# Altium schematic sheet Main.SchDoc
size 863 x 558 mm
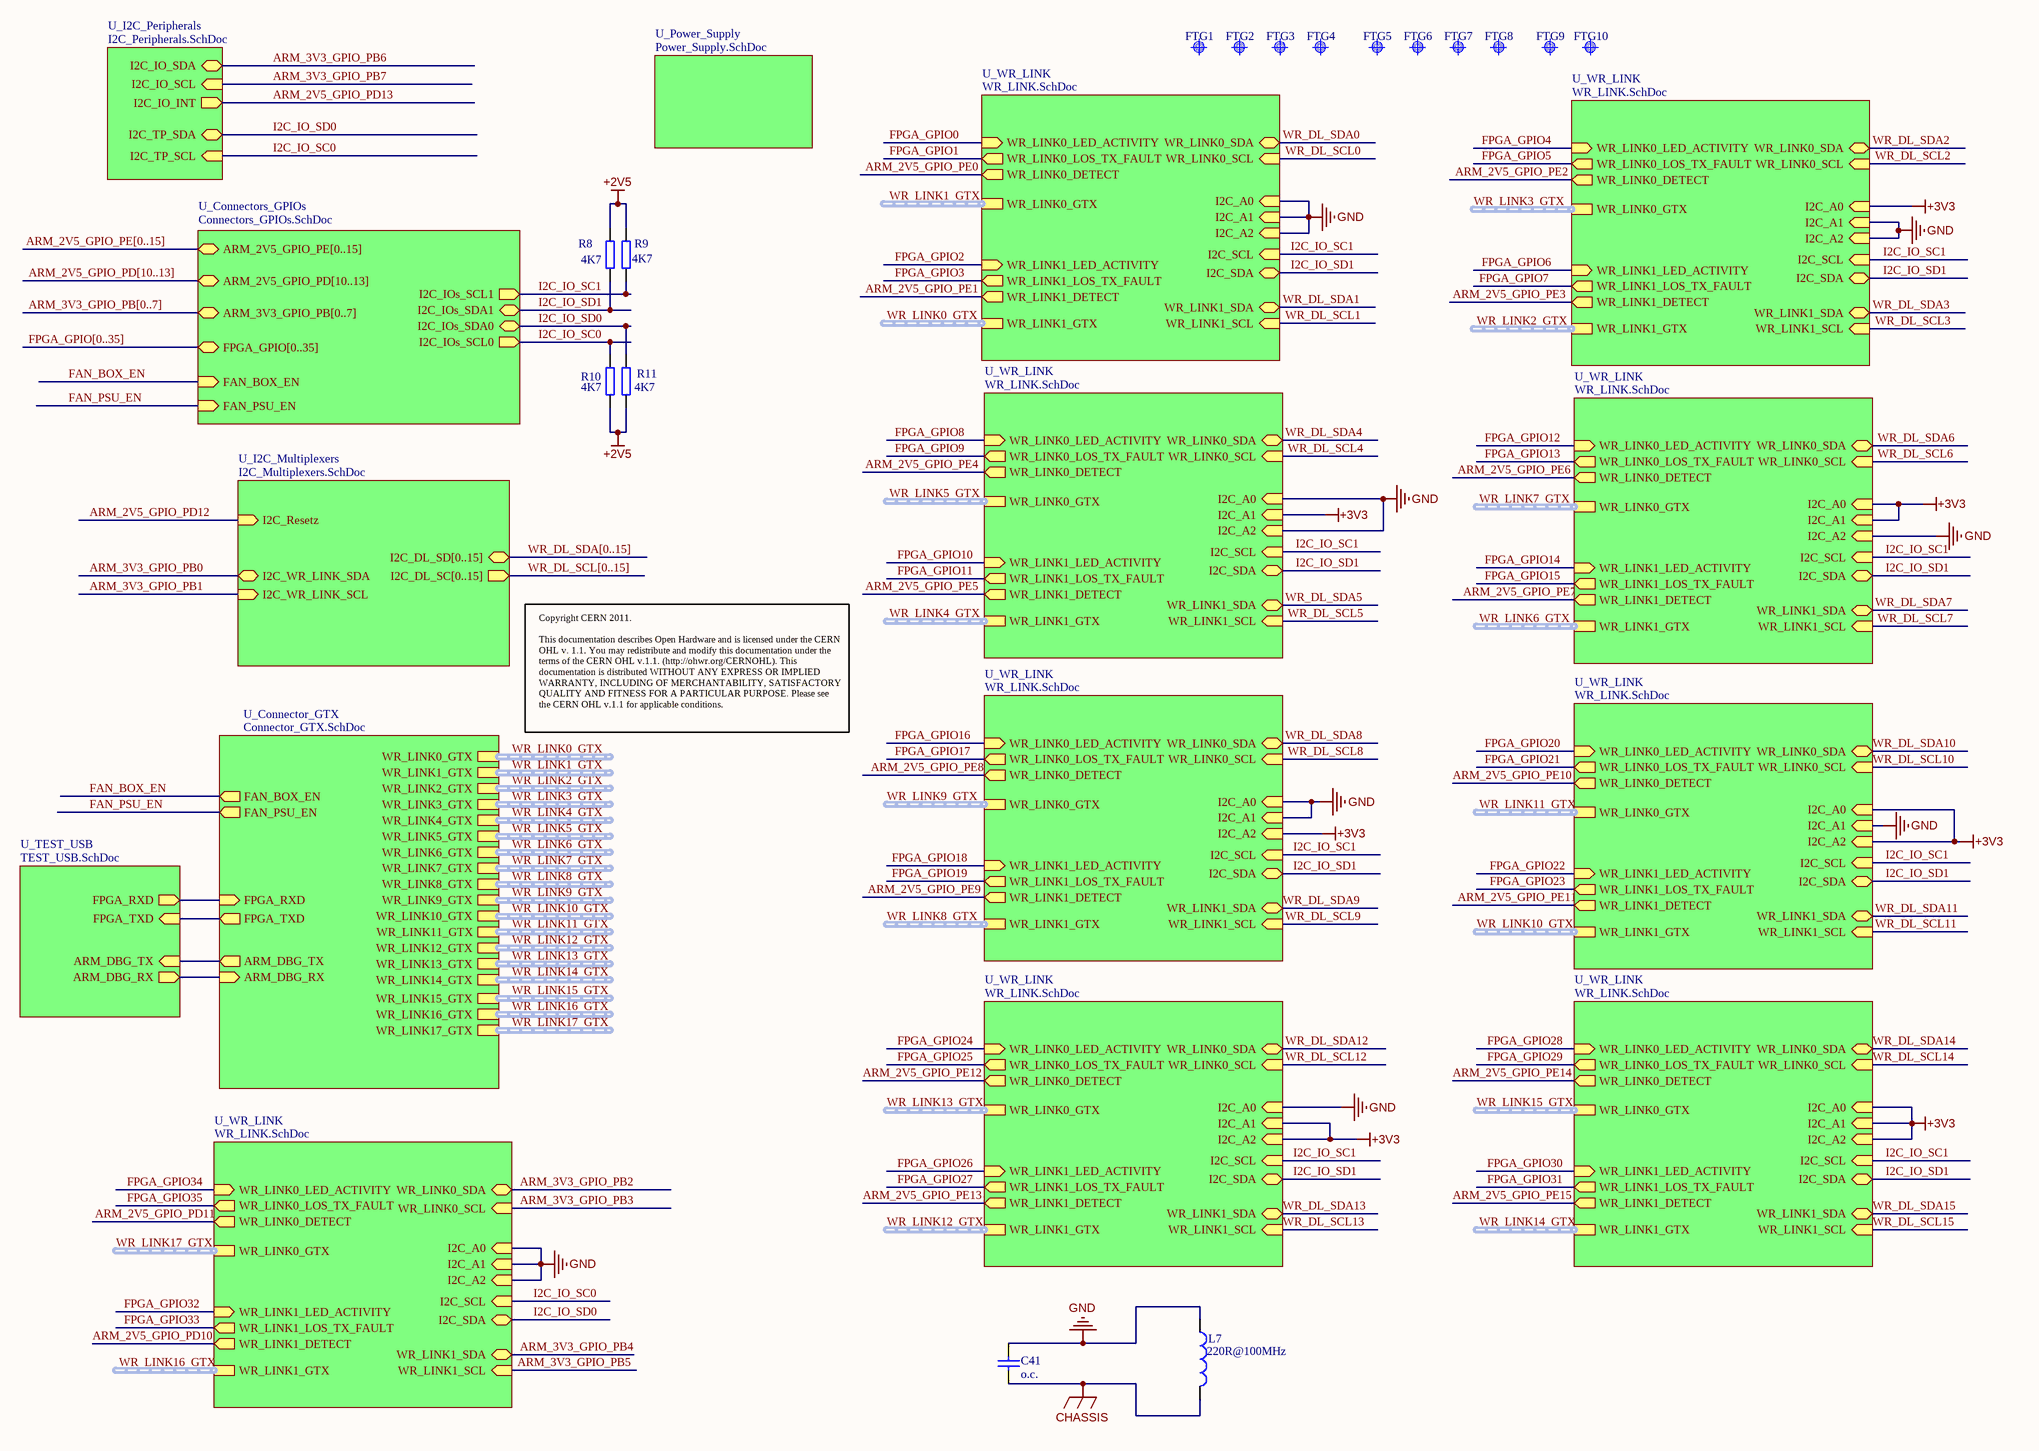
[diagram p0: Main.SchDoc]

## Parts
C41  o.c.  [CC1608-0603]
FTG1  Use only in PCB  [FIDUCIAL_TOP_S100-200]  (value not drawn)
FTG2  Use only in PCB  [FIDUCIAL_TOP_S100-200]  (value not drawn)
FTG3  Use only in PCB  [FIDUCIAL_TOP_S100-200]  (value not drawn)
FTG4  Use only in PCB  [FIDUCIAL_TOP_S100-200]  (value not drawn)
FTG5  Use only in PCB  [FIDUCIAL_TOP_S100-200]  (value not drawn)
FTG6  Use only in PCB  [FIDUCIAL_TOP_S100-200]  (value not drawn)
FTG7  Use only in PCB  [FIDUCIAL_TOP_S100-200]  (value not drawn)
FTG8  Use only in PCB  [FIDUCIAL_TOP_S100-200]  (value not drawn)
FTG9  Use only in PCB  [FIDUCIAL_TOP_S100-200]  (value not drawn)
FTG10  Use only in PCB  [FIDUCIAL_TOP_S100-200]  (value not drawn)
L7  Impedance: 220R@100MHz  [0603]  (hidden comment: 220R@100MHz Ferrite Bead)
R8  4K7  [0603]
R9  4K7  [0603]
R10  4K7  [0603]
R11  4K7  [0603]

## Sub-sheets
U_Connector_GTX = Connector_GTX.SchDoc: WR_LINK0_GTX (harness WR_LINK_GTX), WR_LINK1_GTX (harness WR_LINK_GTX), WR_LINK2_GTX (harness WR_LINK_GTX), WR_LINK3_GTX (harness WR_LINK_GTX), WR_LINK4_GTX (harness WR_LINK_GTX), WR_LINK5_GTX (harness WR_LINK_GTX), WR_LINK6_GTX (harness WR_LINK_GTX), WR_LINK7_GTX (harness WR_LINK_GTX), WR_LINK8_GTX (harness WR_LINK_GTX), WR_LINK9_GTX (harness WR_LINK_GTX), WR_LINK10_GTX (harness WR_LINK_GTX), WR_LINK11_GTX (harness WR_LINK_GTX), WR_LINK17_GTX (harness WR_LINK_GTX), WR_LINK16_GTX (harness WR_LINK_GTX), WR_LINK15_GTX (harness WR_LINK_GTX), WR_LINK14_GTX (harness WR_LINK_GTX), WR_LINK13_GTX (harness WR_LINK_GTX), WR_LINK12_GTX (harness WR_LINK_GTX), FPGA_RXD (in), FPGA_TXD (out), ARM_DBG_TX (out), ARM_DBG_RX (in), FAN_BOX_EN (out), FAN_PSU_EN (out)
U_Connectors_GPIOs = Connectors_GPIOs.SchDoc: ARM_2V5_GPIO_PE[0..15] (bidir), FPGA_GPIO[0..35] (bidir), I2C_IOs_SCL1 (out), I2C_IOs_SDA1 (bidir), I2C_IOs_SCL0 (out), I2C_IOs_SDA0 (bidir), ARM_2V5_GPIO_PD[10..13] (bidir), ARM_3V3_GPIO_PB[0..7] (bidir), FAN_BOX_EN (in), FAN_PSU_EN (in)
U_I2C_Multiplexers = I2C_Multiplexers.SchDoc: I2C_DL_SD[0..15] (bidir), I2C_DL_SC[0..15] (out), I2C_Resetz (in), I2C_WR_LINK_SDA (bidir), I2C_WR_LINK_SCL (in)
U_I2C_Peripherals = I2C_Peripherals.SchDoc: I2C_IO_SDA (bidir), I2C_IO_SCL (in), I2C_IO_INT (out), I2C_TP_SDA (bidir), I2C_TP_SCL (in)
U_Power_Supply = Power_Supply.SchDoc: no entries
U_TEST_USB = TEST_USB.SchDoc: FPGA_RXD (out), FPGA_TXD (in), ARM_DBG_TX (in), ARM_DBG_RX (out)
U_WR_LINK = WR_LINK.SchDoc: WR_LINK0_GTX (harness WR_LINK_GTX), I2C_A0 (in), I2C_A1 (in), I2C_A2 (in), I2C_SDA (bidir), I2C_SCL (in), WR_LINK0_SDA (bidir), WR_LINK0_SCL (in), WR_LINK0_DETECT (out), WR_LINK0_LOS_TX_FAULT (out), WR_LINK0_LED_ACTIVITY (in), WR_LINK1_LED_ACTIVITY (in), WR_LINK1_GTX (harness WR_LINK_GTX), WR_LINK1_SDA (bidir), WR_LINK1_SCL (in), WR_LINK1_DETECT (out), WR_LINK1_LOS_TX_FAULT (out)
U_WR_LINK = WR_LINK.SchDoc: WR_LINK0_GTX (harness WR_LINK_GTX), I2C_A0 (in), I2C_A1 (in), I2C_A2 (in), I2C_SDA (bidir), I2C_SCL (in), WR_LINK0_SDA (bidir), WR_LINK0_SCL (in), WR_LINK0_DETECT (out), WR_LINK0_LOS_TX_FAULT (out), WR_LINK0_LED_ACTIVITY (in), WR_LINK1_LED_ACTIVITY (in), WR_LINK1_GTX (harness WR_LINK_GTX), WR_LINK1_SDA (bidir), WR_LINK1_SCL (in), WR_LINK1_DETECT (out), WR_LINK1_LOS_TX_FAULT (out)
U_WR_LINK = WR_LINK.SchDoc: WR_LINK0_GTX (harness WR_LINK_GTX), I2C_A0 (in), I2C_A1 (in), I2C_A2 (in), I2C_SDA (bidir), I2C_SCL (in), WR_LINK0_SDA (bidir), WR_LINK0_SCL (in), WR_LINK0_DETECT (out), WR_LINK0_LOS_TX_FAULT (out), WR_LINK0_LED_ACTIVITY (in), WR_LINK1_LED_ACTIVITY (in), WR_LINK1_GTX (harness WR_LINK_GTX), WR_LINK1_SDA (bidir), WR_LINK1_SCL (in), WR_LINK1_DETECT (out), WR_LINK1_LOS_TX_FAULT (out)
U_WR_LINK = WR_LINK.SchDoc: WR_LINK0_GTX (harness WR_LINK_GTX), I2C_A0 (in), I2C_A1 (in), I2C_A2 (in), I2C_SDA (bidir), I2C_SCL (in), WR_LINK0_SDA (bidir), WR_LINK0_SCL (in), WR_LINK0_DETECT (out), WR_LINK0_LOS_TX_FAULT (out), WR_LINK0_LED_ACTIVITY (in), WR_LINK1_LED_ACTIVITY (in), WR_LINK1_GTX (harness WR_LINK_GTX), WR_LINK1_SDA (bidir), WR_LINK1_SCL (in), WR_LINK1_DETECT (out), WR_LINK1_LOS_TX_FAULT (out)
U_WR_LINK = WR_LINK.SchDoc: WR_LINK0_GTX (harness WR_LINK_GTX), I2C_A0 (in), I2C_A1 (in), I2C_A2 (in), I2C_SDA (bidir), I2C_SCL (in), WR_LINK0_SDA (bidir), WR_LINK0_SCL (in), WR_LINK0_DETECT (out), WR_LINK0_LOS_TX_FAULT (out), WR_LINK0_LED_ACTIVITY (in), WR_LINK1_LED_ACTIVITY (in), WR_LINK1_GTX (harness WR_LINK_GTX), WR_LINK1_SDA (bidir), WR_LINK1_SCL (in), WR_LINK1_DETECT (out), WR_LINK1_LOS_TX_FAULT (out)
U_WR_LINK = WR_LINK.SchDoc: WR_LINK0_GTX (harness WR_LINK_GTX), I2C_A0 (in), I2C_A1 (in), I2C_A2 (in), I2C_SDA (bidir), I2C_SCL (in), WR_LINK0_SDA (bidir), WR_LINK0_SCL (in), WR_LINK0_DETECT (out), WR_LINK0_LOS_TX_FAULT (out), WR_LINK0_LED_ACTIVITY (in), WR_LINK1_LED_ACTIVITY (in), WR_LINK1_GTX (harness WR_LINK_GTX), WR_LINK1_SDA (bidir), WR_LINK1_SCL (in), WR_LINK1_DETECT (out), WR_LINK1_LOS_TX_FAULT (out)
U_WR_LINK = WR_LINK.SchDoc: WR_LINK0_GTX (harness WR_LINK_GTX), I2C_A0 (in), I2C_A1 (in), I2C_A2 (in), I2C_SDA (bidir), I2C_SCL (in), WR_LINK0_SDA (bidir), WR_LINK0_SCL (in), WR_LINK0_DETECT (out), WR_LINK0_LOS_TX_FAULT (out), WR_LINK0_LED_ACTIVITY (in), WR_LINK1_LED_ACTIVITY (in), WR_LINK1_GTX (harness WR_LINK_GTX), WR_LINK1_SDA (bidir), WR_LINK1_SCL (in), WR_LINK1_DETECT (out), WR_LINK1_LOS_TX_FAULT (out)
U_WR_LINK = WR_LINK.SchDoc: WR_LINK0_GTX (harness WR_LINK_GTX), I2C_A0 (in), I2C_A1 (in), I2C_A2 (in), I2C_SDA (bidir), I2C_SCL (in), WR_LINK0_SDA (bidir), WR_LINK0_SCL (in), WR_LINK0_DETECT (out), WR_LINK0_LOS_TX_FAULT (out), WR_LINK0_LED_ACTIVITY (in), WR_LINK1_LED_ACTIVITY (in), WR_LINK1_GTX (harness WR_LINK_GTX), WR_LINK1_SDA (bidir), WR_LINK1_SCL (in), WR_LINK1_DETECT (out), WR_LINK1_LOS_TX_FAULT (out)
U_WR_LINK = WR_LINK.SchDoc: WR_LINK0_GTX (harness WR_LINK_GTX), I2C_A0 (in), I2C_A1 (in), I2C_A2 (in), I2C_SDA (bidir), I2C_SCL (in), WR_LINK0_SDA (bidir), WR_LINK0_SCL (in), WR_LINK0_DETECT (out), WR_LINK0_LOS_TX_FAULT (out), WR_LINK0_LED_ACTIVITY (in), WR_LINK1_LED_ACTIVITY (in), WR_LINK1_GTX (harness WR_LINK_GTX), WR_LINK1_SDA (bidir), WR_LINK1_SCL (in), WR_LINK1_DETECT (out), WR_LINK1_LOS_TX_FAULT (out)

## Nets
+2V5: R8.2 R9.1 R10.2 R11.1
+3V3: sheet U_WR_LINK/I2C_A0, sheet U_WR_LINK/I2C_A1, sheet U_WR_LINK/I2C_A0, sheet U_WR_LINK/I2C_A1, sheet U_WR_LINK/I2C_A2, sheet U_WR_LINK/I2C_A0, sheet U_WR_LINK/I2C_A2, sheet U_WR_LINK/I2C_A1, sheet U_WR_LINK/I2C_A2, sheet U_WR_LINK/I2C_A0, sheet U_WR_LINK/I2C_A1, sheet U_WR_LINK/I2C_A2
CHASSIS: C41.1 L7.2
GND: C41.2 L7.1 ; sheet U_WR_LINK/I2C_A0, sheet U_WR_LINK/I2C_A1, sheet U_WR_LINK/I2C_A2, sheet U_WR_LINK/I2C_A1, sheet U_WR_LINK/I2C_A2, sheet U_WR_LINK/I2C_A0, sheet U_WR_LINK/I2C_A2, sheet U_WR_LINK/I2C_A2, sheet U_WR_LINK/I2C_A0, sheet U_WR_LINK/I2C_A1, sheet U_WR_LINK/I2C_A1, sheet U_WR_LINK/I2C_A0, sheet U_WR_LINK/I2C_A0, sheet U_WR_LINK/I2C_A1, sheet U_WR_LINK/I2C_A2
ARM_2V5_GPIO_PD10: sheet U_WR_LINK/WR_LINK1_DETECT
ARM_2V5_GPIO_PD11: sheet U_WR_LINK/WR_LINK0_DETECT
ARM_2V5_GPIO_PD12: sheet U_I2C_Multiplexers/I2C_Resetz
ARM_2V5_GPIO_PD13: sheet U_I2C_Peripherals/I2C_IO_INT
ARM_2V5_GPIO_PE0: sheet U_WR_LINK/WR_LINK0_DETECT
ARM_2V5_GPIO_PE1: sheet U_WR_LINK/WR_LINK1_DETECT
ARM_2V5_GPIO_PE2: sheet U_WR_LINK/WR_LINK0_DETECT
ARM_2V5_GPIO_PE3: sheet U_WR_LINK/WR_LINK1_DETECT
ARM_2V5_GPIO_PE4: sheet U_WR_LINK/WR_LINK0_DETECT
ARM_2V5_GPIO_PE5: sheet U_WR_LINK/WR_LINK1_DETECT
ARM_2V5_GPIO_PE6: sheet U_WR_LINK/WR_LINK0_DETECT
ARM_2V5_GPIO_PE7: sheet U_WR_LINK/WR_LINK1_DETECT
ARM_2V5_GPIO_PE8: sheet U_WR_LINK/WR_LINK0_DETECT
ARM_2V5_GPIO_PE9: sheet U_WR_LINK/WR_LINK1_DETECT
ARM_2V5_GPIO_PE10: sheet U_WR_LINK/WR_LINK0_DETECT
ARM_2V5_GPIO_PE11: sheet U_WR_LINK/WR_LINK1_DETECT
ARM_2V5_GPIO_PE12: sheet U_WR_LINK/WR_LINK0_DETECT
ARM_2V5_GPIO_PE13: sheet U_WR_LINK/WR_LINK1_DETECT
ARM_2V5_GPIO_PE14: sheet U_WR_LINK/WR_LINK0_DETECT
ARM_2V5_GPIO_PE15: sheet U_WR_LINK/WR_LINK1_DETECT
ARM_3V3_GPIO_PB0: sheet U_I2C_Multiplexers/I2C_WR_LINK_SDA
ARM_3V3_GPIO_PB1: sheet U_I2C_Multiplexers/I2C_WR_LINK_SCL
ARM_3V3_GPIO_PB2: sheet U_WR_LINK/WR_LINK0_SDA
ARM_3V3_GPIO_PB3: sheet U_WR_LINK/WR_LINK0_SCL
ARM_3V3_GPIO_PB4: sheet U_WR_LINK/WR_LINK1_SDA
ARM_3V3_GPIO_PB5: sheet U_WR_LINK/WR_LINK1_SCL
ARM_3V3_GPIO_PB6: sheet U_I2C_Peripherals/I2C_IO_SDA
ARM_3V3_GPIO_PB7: sheet U_I2C_Peripherals/I2C_IO_SCL
FAN_BOX_EN: sheet U_Connector_GTX/FAN_BOX_EN, sheet U_Connectors_GPIOs/FAN_BOX_EN
FAN_PSU_EN: sheet U_Connector_GTX/FAN_PSU_EN, sheet U_Connectors_GPIOs/FAN_PSU_EN
FPGA_GPIO0: sheet U_WR_LINK/WR_LINK0_LED_ACTIVITY
FPGA_GPIO1: sheet U_WR_LINK/WR_LINK0_LOS_TX_FAULT
FPGA_GPIO2: sheet U_WR_LINK/WR_LINK1_LED_ACTIVITY
FPGA_GPIO3: sheet U_WR_LINK/WR_LINK1_LOS_TX_FAULT
FPGA_GPIO4: sheet U_WR_LINK/WR_LINK0_LED_ACTIVITY
FPGA_GPIO5: sheet U_WR_LINK/WR_LINK0_LOS_TX_FAULT
FPGA_GPIO6: sheet U_WR_LINK/WR_LINK1_LED_ACTIVITY
FPGA_GPIO7: sheet U_WR_LINK/WR_LINK1_LOS_TX_FAULT
FPGA_GPIO8: sheet U_WR_LINK/WR_LINK0_LED_ACTIVITY
FPGA_GPIO9: sheet U_WR_LINK/WR_LINK0_LOS_TX_FAULT
FPGA_GPIO10: sheet U_WR_LINK/WR_LINK1_LED_ACTIVITY
FPGA_GPIO11: sheet U_WR_LINK/WR_LINK1_LOS_TX_FAULT
FPGA_GPIO12: sheet U_WR_LINK/WR_LINK0_LED_ACTIVITY
FPGA_GPIO13: sheet U_WR_LINK/WR_LINK0_LOS_TX_FAULT
FPGA_GPIO14: sheet U_WR_LINK/WR_LINK1_LED_ACTIVITY
FPGA_GPIO15: sheet U_WR_LINK/WR_LINK1_LOS_TX_FAULT
FPGA_GPIO16: sheet U_WR_LINK/WR_LINK0_LED_ACTIVITY
FPGA_GPIO17: sheet U_WR_LINK/WR_LINK0_LOS_TX_FAULT
FPGA_GPIO18: sheet U_WR_LINK/WR_LINK1_LED_ACTIVITY
FPGA_GPIO19: sheet U_WR_LINK/WR_LINK1_LOS_TX_FAULT
FPGA_GPIO20: sheet U_WR_LINK/WR_LINK0_LED_ACTIVITY
FPGA_GPIO21: sheet U_WR_LINK/WR_LINK0_LOS_TX_FAULT
FPGA_GPIO22: sheet U_WR_LINK/WR_LINK1_LED_ACTIVITY
FPGA_GPIO23: sheet U_WR_LINK/WR_LINK1_LOS_TX_FAULT
FPGA_GPIO24: sheet U_WR_LINK/WR_LINK0_LED_ACTIVITY
FPGA_GPIO25: sheet U_WR_LINK/WR_LINK0_LOS_TX_FAULT
FPGA_GPIO26: sheet U_WR_LINK/WR_LINK1_LED_ACTIVITY
FPGA_GPIO27: sheet U_WR_LINK/WR_LINK1_LOS_TX_FAULT
FPGA_GPIO28: sheet U_WR_LINK/WR_LINK0_LED_ACTIVITY
FPGA_GPIO29: sheet U_WR_LINK/WR_LINK0_LOS_TX_FAULT
FPGA_GPIO30: sheet U_WR_LINK/WR_LINK1_LED_ACTIVITY
FPGA_GPIO31: sheet U_WR_LINK/WR_LINK1_LOS_TX_FAULT
FPGA_GPIO32: sheet U_WR_LINK/WR_LINK1_LED_ACTIVITY
FPGA_GPIO33: sheet U_WR_LINK/WR_LINK1_LOS_TX_FAULT
FPGA_GPIO34: sheet U_WR_LINK/WR_LINK0_LED_ACTIVITY
FPGA_GPIO35: sheet U_WR_LINK/WR_LINK0_LOS_TX_FAULT
I2C_IO_SC0: R10.1 ; sheet U_Connectors_GPIOs/I2C_IOs_SCL0, sheet U_WR_LINK/I2C_SCL, sheet U_I2C_Peripherals/I2C_TP_SCL
I2C_IO_SC1: R9.2 ; sheet U_Connectors_GPIOs/I2C_IOs_SCL1, sheet U_WR_LINK/I2C_SCL, sheet U_WR_LINK/I2C_SCL, sheet U_WR_LINK/I2C_SCL, sheet U_WR_LINK/I2C_SCL, sheet U_WR_LINK/I2C_SCL, sheet U_WR_LINK/I2C_SCL, sheet U_WR_LINK/I2C_SCL, sheet U_WR_LINK/I2C_SCL
I2C_IO_SD0: R11.2 ; sheet U_Connectors_GPIOs/I2C_IOs_SDA0, sheet U_WR_LINK/I2C_SDA, sheet U_I2C_Peripherals/I2C_TP_SDA
I2C_IO_SD1: R8.1 ; sheet U_Connectors_GPIOs/I2C_IOs_SDA1, sheet U_WR_LINK/I2C_SDA, sheet U_WR_LINK/I2C_SDA, sheet U_WR_LINK/I2C_SDA, sheet U_WR_LINK/I2C_SDA, sheet U_WR_LINK/I2C_SDA, sheet U_WR_LINK/I2C_SDA, sheet U_WR_LINK/I2C_SDA, sheet U_WR_LINK/I2C_SDA
WR_DL_SCL0: sheet U_WR_LINK/WR_LINK0_SCL
WR_DL_SCL1: sheet U_WR_LINK/WR_LINK1_SCL
WR_DL_SCL2: sheet U_WR_LINK/WR_LINK0_SCL
WR_DL_SCL3: sheet U_WR_LINK/WR_LINK1_SCL
WR_DL_SCL4: sheet U_WR_LINK/WR_LINK0_SCL
WR_DL_SCL5: sheet U_WR_LINK/WR_LINK1_SCL
WR_DL_SCL6: sheet U_WR_LINK/WR_LINK0_SCL
WR_DL_SCL7: sheet U_WR_LINK/WR_LINK1_SCL
WR_DL_SCL8: sheet U_WR_LINK/WR_LINK0_SCL
WR_DL_SCL9: sheet U_WR_LINK/WR_LINK1_SCL
WR_DL_SCL10: sheet U_WR_LINK/WR_LINK0_SCL
WR_DL_SCL11: sheet U_WR_LINK/WR_LINK1_SCL
WR_DL_SCL12: sheet U_WR_LINK/WR_LINK0_SCL
WR_DL_SCL13: sheet U_WR_LINK/WR_LINK1_SCL
WR_DL_SCL14: sheet U_WR_LINK/WR_LINK0_SCL
WR_DL_SCL15: sheet U_WR_LINK/WR_LINK1_SCL
WR_DL_SDA0: sheet U_WR_LINK/WR_LINK0_SDA
WR_DL_SDA1: sheet U_WR_LINK/WR_LINK1_SDA
WR_DL_SDA2: sheet U_WR_LINK/WR_LINK0_SDA
WR_DL_SDA3: sheet U_WR_LINK/WR_LINK1_SDA
WR_DL_SDA4: sheet U_WR_LINK/WR_LINK0_SDA
WR_DL_SDA5: sheet U_WR_LINK/WR_LINK1_SDA
WR_DL_SDA6: sheet U_WR_LINK/WR_LINK0_SDA
WR_DL_SDA7: sheet U_WR_LINK/WR_LINK1_SDA
WR_DL_SDA8: sheet U_WR_LINK/WR_LINK0_SDA
WR_DL_SDA9: sheet U_WR_LINK/WR_LINK1_SDA
WR_DL_SDA10: sheet U_WR_LINK/WR_LINK0_SDA
WR_DL_SDA11: sheet U_WR_LINK/WR_LINK1_SDA
WR_DL_SDA12: sheet U_WR_LINK/WR_LINK0_SDA
WR_DL_SDA13: sheet U_WR_LINK/WR_LINK1_SDA
WR_DL_SDA14: sheet U_WR_LINK/WR_LINK0_SDA
WR_DL_SDA15: sheet U_WR_LINK/WR_LINK1_SDA
(unnamed): sheet U_Connector_GTX/FPGA_RXD, sheet U_TEST_USB/FPGA_RXD
(unnamed): sheet U_Connector_GTX/FPGA_TXD, sheet U_TEST_USB/FPGA_TXD
(unnamed): sheet U_Connector_GTX/ARM_DBG_TX, sheet U_TEST_USB/ARM_DBG_TX
(unnamed): sheet U_Connector_GTX/ARM_DBG_RX, sheet U_TEST_USB/ARM_DBG_RX

## Buses and harness runs
bus ARM_2V5_GPIO_PD[10..13] = sheet U_Connectors_GPIOs/ARM_2V5_GPIO_PD[10..13]
bus ARM_2V5_GPIO_PE[0..15] = sheet U_Connectors_GPIOs/ARM_2V5_GPIO_PE[0..15]
bus ARM_3V3_GPIO_PB[0..7] = sheet U_Connectors_GPIOs/ARM_3V3_GPIO_PB[0..7]
bus FPGA_GPIO[0..35] = sheet U_Connectors_GPIOs/FPGA_GPIO[0..35]
bus WR_DL_SCL[0..15] = sheet U_I2C_Multiplexers/I2C_DL_SC[0..15]
bus WR_DL_SDA[0..15] = sheet U_I2C_Multiplexers/I2C_DL_SD[0..15]
harness WR_LINK0_GTX = sheet U_Connector_GTX/WR_LINK0_GTX
harness WR_LINK0_GTX = sheet U_WR_LINK/WR_LINK1_GTX
harness WR_LINK1_GTX = sheet U_Connector_GTX/WR_LINK1_GTX
harness WR_LINK1_GTX = sheet U_WR_LINK/WR_LINK0_GTX
harness WR_LINK2_GTX = sheet U_Connector_GTX/WR_LINK2_GTX
harness WR_LINK2_GTX = sheet U_WR_LINK/WR_LINK1_GTX
harness WR_LINK3_GTX = sheet U_Connector_GTX/WR_LINK3_GTX
harness WR_LINK3_GTX = sheet U_WR_LINK/WR_LINK0_GTX
harness WR_LINK4_GTX = sheet U_Connector_GTX/WR_LINK4_GTX
harness WR_LINK4_GTX = sheet U_WR_LINK/WR_LINK1_GTX
harness WR_LINK5_GTX = sheet U_Connector_GTX/WR_LINK5_GTX
harness WR_LINK5_GTX = sheet U_WR_LINK/WR_LINK0_GTX
harness WR_LINK6_GTX = sheet U_Connector_GTX/WR_LINK6_GTX
harness WR_LINK6_GTX = sheet U_WR_LINK/WR_LINK1_GTX
harness WR_LINK7_GTX = sheet U_Connector_GTX/WR_LINK7_GTX
harness WR_LINK7_GTX = sheet U_WR_LINK/WR_LINK0_GTX
harness WR_LINK8_GTX = sheet U_Connector_GTX/WR_LINK8_GTX
harness WR_LINK8_GTX = sheet U_WR_LINK/WR_LINK1_GTX
harness WR_LINK9_GTX = sheet U_Connector_GTX/WR_LINK9_GTX
harness WR_LINK9_GTX = sheet U_WR_LINK/WR_LINK0_GTX
harness WR_LINK10_GTX = sheet U_Connector_GTX/WR_LINK10_GTX
harness WR_LINK10_GTX = sheet U_WR_LINK/WR_LINK1_GTX
harness WR_LINK11_GTX = sheet U_Connector_GTX/WR_LINK11_GTX
harness WR_LINK11_GTX = sheet U_WR_LINK/WR_LINK0_GTX
harness WR_LINK12_GTX = sheet U_Connector_GTX/WR_LINK12_GTX
harness WR_LINK12_GTX = sheet U_WR_LINK/WR_LINK1_GTX
harness WR_LINK13_GTX = sheet U_Connector_GTX/WR_LINK13_GTX
harness WR_LINK13_GTX = sheet U_WR_LINK/WR_LINK0_GTX
harness WR_LINK14_GTX = sheet U_Connector_GTX/WR_LINK14_GTX
harness WR_LINK14_GTX = sheet U_WR_LINK/WR_LINK1_GTX
harness WR_LINK15_GTX = sheet U_Connector_GTX/WR_LINK15_GTX
harness WR_LINK15_GTX = sheet U_WR_LINK/WR_LINK0_GTX
harness WR_LINK16_GTX = sheet U_Connector_GTX/WR_LINK16_GTX
harness WR_LINK16_GTX = sheet U_WR_LINK/WR_LINK1_GTX
harness WR_LINK17_GTX = sheet U_Connector_GTX/WR_LINK17_GTX
harness WR_LINK17_GTX = sheet U_WR_LINK/WR_LINK0_GTX

## Notes on the sheet
- Copyright CERN 2011.
  This documentation describes Open Hardware and is licensed under the CERN OHL v. 1.1. You may redistribute and modify this documentation under the terms of the CERN OHL v.1.1. (http://ohwr.org/CERNOHL). This documentation is distributed WITHOUT ANY EXPRESS OR IMPLIED WARRANTY, INCLUDING OF MERCHANTABILITY, SATISFACTORY QUALITY AND FITNESS FOR A PARTICULAR PURPOSE. Please see the CERN OHL v.1.1 for applicable conditions.
- DWG. NO.
- REV.
- SHT.
- REVISION
- DESCRIPTION
- DATE
- APPROVED
- THIS DOCUMENT AND THE DATA DISCLOSED HEREIN OR HEREWITH IS THE PROPERTY OF ALTIUM LIMITED AND MAY BE FREELY DISTRIBUTED IN WHOLE. NO RIGHTS ARE RESERVED OR EXPRESS OR IMPLIED WARANTEE GIVEN.
- ENG:
- DSN:
- APPROVALS
- PROJECT
- DOCUMENT REVISION:
- DESIGN ITEM:
- CHK:
- BOM:
- REFERENCE DOCUMENTS
- PROJECT REVISION:
- TITLE
- FAB DWG:
- PCB DWG:
- ASSY DWG:
- SCALE:
- SIZE
- D
- CAGE CODE
- FILE NAME
- DWG NO.
- SHEET
- OF
- REV

## Library data of the parts
C41 = CC0603_O.C.: Capacitor; Manufacturer1: Phycomp; TC: X7R; Tolerance: ±10%; Voltage: 16V; Published: 8-Jun-2000; LatestRevisionDate: 17-Jul-2002; LatestRevisionNote: Re-released for DXP Platform.; PackageReference: RAD-0.3; Publisher: Altium Limited; Manufacturer1 PN: *; Distributor1: Digikey; Distributor1 PN: *; Case: 0603; Value: o.c.
FTG1-FTG10 = Fiducial Target: Part Number: FIDUCIAL_TARGET_S100-200; Part Description: Scare Fiducial Target, Top Layer, 1.0mm, Top Sloder 2.0mm, Keepout =2.0mm; Mounted: No; Table: Pads; Component Kind: Standard (No BOM); Component Type: Standard (No BOM); Pin Count: 1; Family: Fiducial; Socket: No; SMD: Yes; Status: None; ComponentHeight: 0mm; Author: CERN DEM JLC; CreateDate: 2/9/2010; LatestRevisionDate: 2/9/2010; PackageDescription: Scare Fiducial Target, Top Layer, 1.0mm, Top Sloder 2.0mm, Keepout =2.0mm
L7 = L_FERRITE_BEAD: ferrite bead; Manufacturer1: Murata; Manufacturer1 PN: BLM18KG221SN1D; Current Rating: 2.2A; DCR: 50mOhm; Case: 0603; Distributor1: Digikey; Distributor1 PN: 490-5255-1-ND
R8-R11 = R0603_4.7K_±1%_0.1W_100PPM: SMD Resistor; Manufacturer1: Panasonic; Manufacturer1 PN: ERJ-3EKF4701V; TCR: 100ppm; Power Rating: 0.1W; Tolerance: ±1%; Case: 0603; Distributor1: DigiKey; Distributor1 PN: P4.70KHCT-ND; Value: 4K7